# EAGLE schematic 555LED (EAGLE 8.1.1)
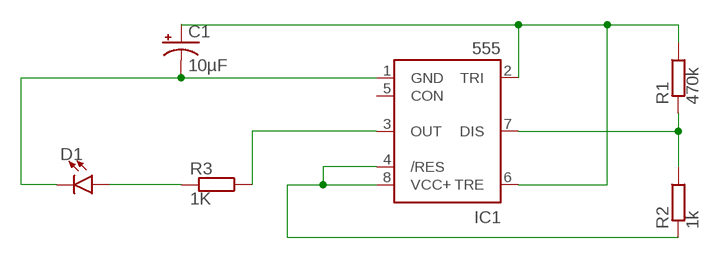
[diagram p0: schematic, sheet 1]

## Parts
C1  10µF  10UF-POLAR-EIA6032-25V-10%  [EIA6032-NOM]
D1  LED1206  [LED-1206]
IC1  555  555D  [SO08]
R1  470k  BVS  [BVS]
R2  1k  BVS  [BVS]
R3  1K  BVS  [BVS]

## Nets
N$1: IC1.3(OUT) R3.1
N$2: D1.A R3.2
N$3: IC1.4(/RES) IC1.8(VCC+) R2.2
N$4: C1.C(-) D1.C IC1.1(GND)
N$5: C1.A(+) IC1.2(TRI) IC1.6(TRE) R1.1
N$7: IC1.7(DIS) R1.2 R2.1
Unconnected: IC1.5(CON)

## Library data of the parts
C1 = SparkFun-Capacitors:10UF-POLAR: 10.0µF polarized capacitors A capacitor is a passive two-terminal electrical component used to store electrical energy temporarily in an electric field.; PROD_ID: CAP-12984
D1 = SparkFun-LED:LED: LED (Generic) Standard schematic elements and footprints for 5mm, 3mm, 1206, and 0603 sized LEDs. Generic LEDs with no color specified.
IC1 = SparkFun-IC-Special-Function:555: General purpose bipolar Timer Datasheet <http://www.sparkfun.com/datasheets/Components/General/ne555.pdf> SparkFun Products SparkFun SparkPunk Sequencer Kit <https://www.sparkfun.com/products/12707> (KIT-12707) Storefront Component: 555 Timer <https://www.sparkfun.com/products/9273> (COM-09273) Two parts valid for production: VFP: IC-11930 (M7555 PTH) VFP: IC-09173 (555 PTH) - Preferred; PROD_ID: NA-XXXXX
R1-R3 = resistor-shunt:BVS: SMD SHUNT RESISTOR; OC_FARNELL: unknown; OC_NEWARK: unknown